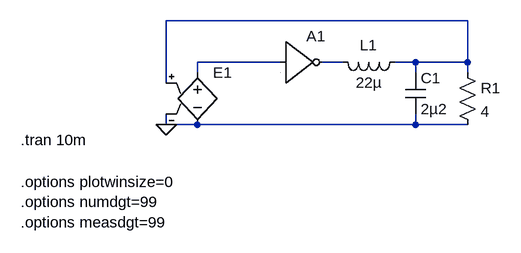
[diagram p0: schematic loop_filter_sim.asc]
loop_filter_sim.asc, the LTspice schematic file:
Version 4
SHEET 1 2720 680
WIRE 608 48 144 48
WIRE 320 112 192 112
WIRE 416 112 384 112
WIRE 528 112 496 112
WIRE 608 112 608 48
WIRE 608 112 528 112
WIRE 192 128 192 112
WIRE 528 128 528 112
WIRE 608 128 608 112
WIRE 144 144 144 48
WIRE 144 208 144 192
WIRE 192 208 144 208
WIRE 528 208 528 192
WIRE 528 208 192 208
WIRE 608 208 528 208
FLAG 144 208 0
SYMBOL e 192 112 R0
WINDOW 3 24 44 Invisible 2
SYMATTR InstName E1
SYMATTR Value Laplace=(10 * s^4 + 3.531e+08 * s^3 + 1.1e+16 * s^2 + 1.877e+22 * s + 4.974e+28)/(s^4 + 4.991e+07 * s^3 + 1.561e+15 * s^2 + 1.655e+22 * s + 4.935e+28)
SYMBOL Digital\\inv 320 48 R0
WINDOW 3 8 60 Invisible 2
SYMATTR InstName A1
SYMATTR Value Ref=0, Vhigh=48, Vlow=-48, Trise=1n, Td=40n, Rout=1m
SYMBOL ind 512 96 R90
WINDOW 0 5 56 VBottom 2
WINDOW 3 32 56 VTop 2
SYMATTR InstName L1
SYMATTR Value 22µ
SYMBOL cap 512 128 R0
SYMATTR InstName C1
SYMATTR Value 2µ2
SYMBOL res 592 112 R0
SYMATTR InstName R1
SYMATTR Value 4
TEXT -80 232 Left 2 !.tran 10m
TEXT -80 296 Left 2 !.options plotwinsize=0\n.options numdgt=99\n.options measdgt=99

The netlist it stands for:
* loop_filter_sim.asc
E1 N002 0 N001 0 Laplace=(10 * s^4 + 3.531e+08 * s^3 + 1.1e+16 * s^2 + 1.877e+22 * s + 4.974e+28)/(s^4 + 4.991e+07 * s^3 + 1.561e+15 * s^2 + 1.655e+22 * s + 4.935e+28)
A1 N002 0 0 0 0 N003 0 0 BUF Ref=0, Vhigh=48, Vlow=-48, Trise=1n, Td=40n, Rout=1m
L1 N001 N003 22µ
C1 N001 0 2µ2
R1 N001 0 4
.tran 10m
.options plotwinsize=0
.options numdgt=99
.options measdgt=99
.backanno
.end